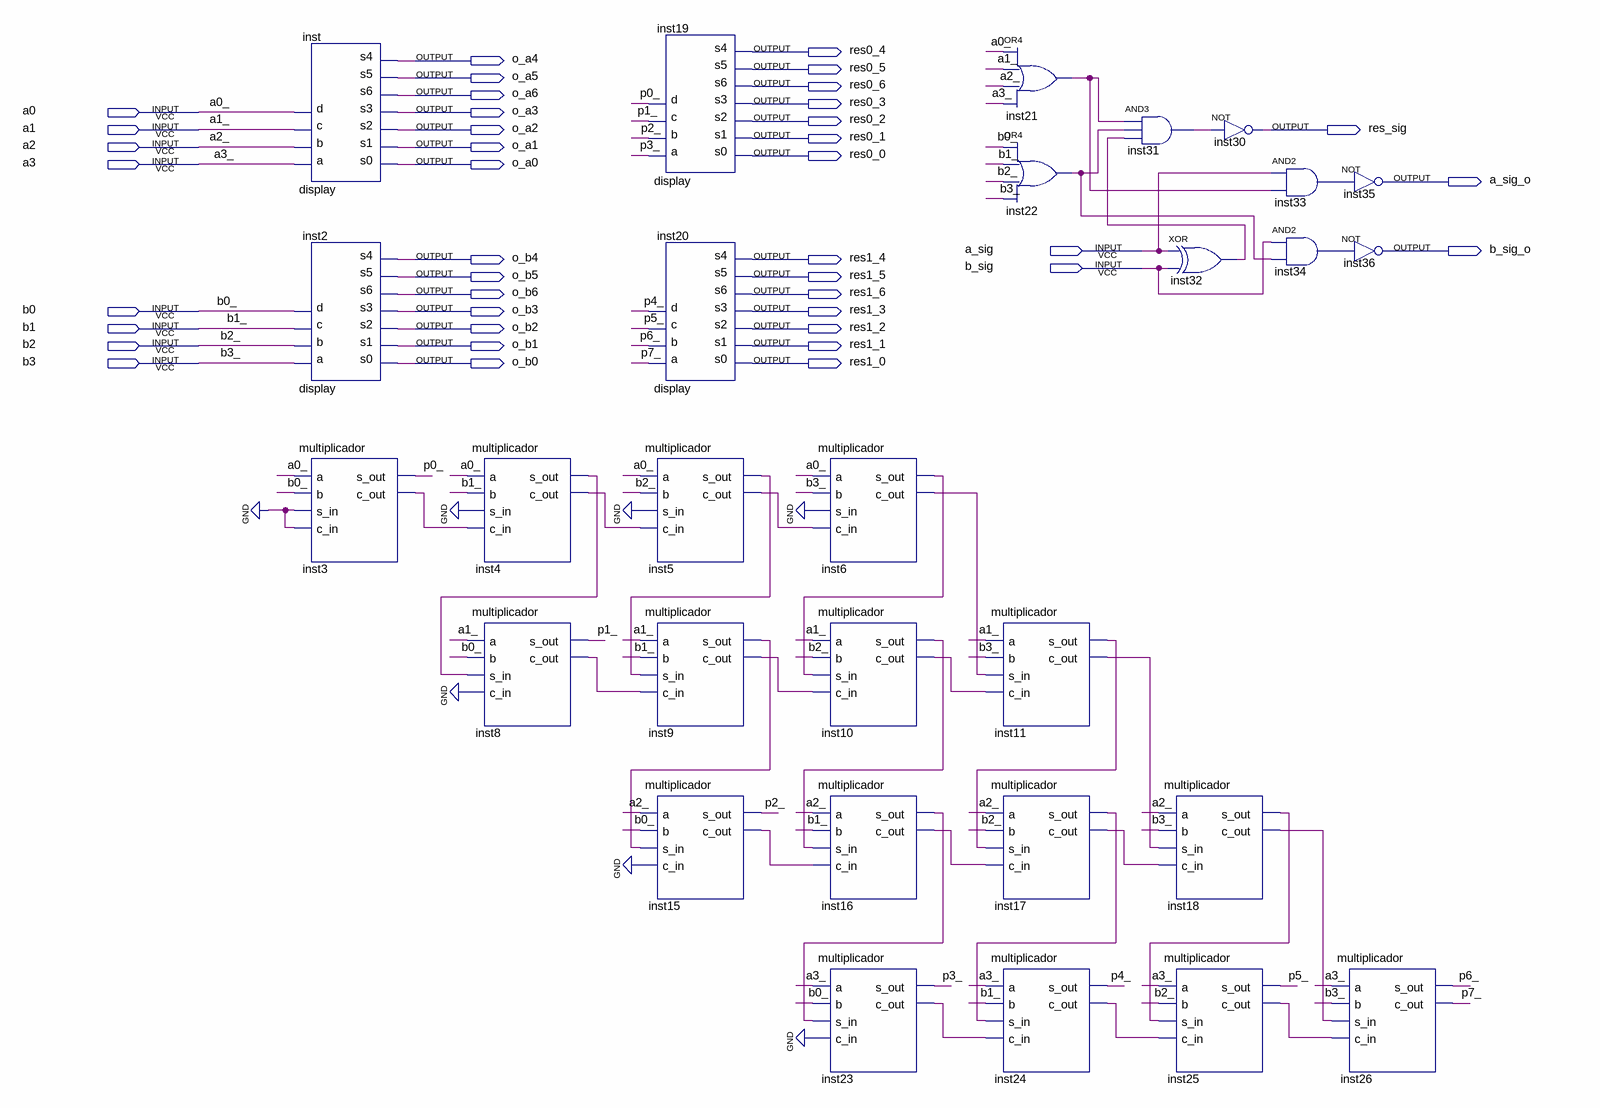
[diagram p0: schematic sheet]
// Quartus schematic aula10.bdf as structural Verilog: 29 symbols, 41 pins
module aula10 (
  input  a0,
  input  a1,
  input  a2,
  input  a3,
  input  a_sig,
  input  b_sig,
  input  b0,
  input  b1,
  input  b2,
  input  b3,
  output res0_4,
  output o_a4,
  output res0_5,
  output o_a5,
  output res0_6,
  output o_a6,
  output res0_3,
  output o_a3,
  output res0_2,
  output o_a2,
  output res_sig,
  output res0_1,
  output o_a1,
  output res0_0,
  output o_a0,
  output a_sig_o,
  output b_sig_o,
  output o_b4,
  output res1_4,
  output o_b5,
  output res1_5,
  output o_b6,
  output res1_6,
  output o_b3,
  output res1_3,
  output o_b2,
  output res1_2,
  output o_b1,
  output res1_1,
  output o_b0,
  output res1_0
);

  wire inst3_c_out, inst4_c_out, inst4_s_out, inst5_c_out, inst5_s_out, inst6_c_out, inst6_s_out,
       inst8_c_out, inst9_c_out, inst9_s_out, inst10_c_out, inst10_s_out, inst11_c_out, inst11_s_out,
       inst15_c_out, inst16_c_out, inst16_s_out, inst17_c_out, inst17_s_out, inst18_c_out, inst18_s_out,
       inst21_out, inst22_out, inst23_c_out, inst24_c_out, inst25_c_out, inst31_out, inst32_out, inst33_out,
       inst34_out, p0_, p1_, p2_, p3_, p4_, p5_, p6_, p7_;

  display inst (
    .a(a3), .b(a2), .c(a1), .d(a0), .s0(o_a0), .s1(o_a1), .s2(o_a2), .s3(o_a3), .s6(o_a6), .s5(o_a5),
    .s4(o_a4));
  display inst2 (
    .a(b3), .b(b2), .c(b1), .d(b0), .s0(o_b0), .s1(o_b1), .s2(o_b2), .s3(o_b3), .s6(o_b6), .s5(o_b5),
    .s4(o_b4));
  multiplicador inst3 (.a(a0), .b(b0), .s_in(1'b0), .c_in(1'b0), .s_out(p0_), .c_out(inst3_c_out));
  multiplicador inst4 (.a(a0), .b(b1), .s_in(1'b0), .c_in(inst3_c_out), .s_out(inst4_s_out), .c_out(inst4_c_out));
  multiplicador inst8 (.a(a1), .b(b0), .s_in(inst4_s_out), .c_in(1'b0), .s_out(p1_), .c_out(inst8_c_out));
  display inst19 (
    .a(p3_), .b(p2_), .c(p1_), .d(p0_), .s0(res0_0), .s1(res0_1), .s2(res0_2), .s3(res0_3), .s6(res0_6),
    .s5(res0_5), .s4(res0_4));
  display inst20 (
    .a(p7_), .b(p6_), .c(p5_), .d(p4_), .s0(res1_0), .s1(res1_1), .s2(res1_2), .s3(res1_3), .s6(res1_6),
    .s5(res1_5), .s4(res1_4));
  multiplicador inst5 (.a(a0), .b(b2), .s_in(1'b0), .c_in(inst4_c_out), .s_out(inst5_s_out), .c_out(inst5_c_out));
  multiplicador inst9 (
    .a(a1), .b(b1), .s_in(inst5_s_out), .c_in(inst8_c_out), .s_out(inst9_s_out), .c_out(inst9_c_out));
  multiplicador inst15 (.a(a2), .b(b0), .s_in(inst9_s_out), .c_in(1'b0), .s_out(p2_), .c_out(inst15_c_out));
  multiplicador inst6 (.a(a0), .b(b3), .s_in(1'b0), .c_in(inst5_c_out), .s_out(inst6_s_out), .c_out(inst6_c_out));
  multiplicador inst10 (
    .a(a1), .b(b2), .s_in(inst6_s_out), .c_in(inst9_c_out), .s_out(inst10_s_out), .c_out(inst10_c_out));
  multiplicador inst16 (
    .a(a2), .b(b1), .s_in(inst10_s_out), .c_in(inst15_c_out), .s_out(inst16_s_out), .c_out(inst16_c_out));
  multiplicador inst23 (.a(a3), .b(b0), .s_in(inst16_s_out), .c_in(1'b0), .s_out(p3_), .c_out(inst23_c_out));
  or inst21 (inst21_out, a0, a1, a2, a3);
  or inst22 (inst22_out, b0, b1, b2, b3);
  multiplicador inst11 (
    .a(a1), .b(b3), .s_in(inst6_c_out), .c_in(inst10_c_out), .s_out(inst11_s_out), .c_out(inst11_c_out));
  multiplicador inst17 (
    .a(a2), .b(b2), .s_in(inst11_s_out), .c_in(inst16_c_out), .s_out(inst17_s_out), .c_out(inst17_c_out));
  multiplicador inst24 (.a(a3), .b(b1), .s_in(inst17_s_out), .c_in(inst23_c_out), .s_out(p4_), .c_out(inst24_c_out));
  and inst31 (inst31_out, inst21_out, inst22_out, inst32_out);
  not inst30 (res_sig, inst31_out);
  xor inst32 (inst32_out, a_sig, b_sig);
  multiplicador inst18 (
    .a(a2), .b(b3), .s_in(inst11_c_out), .c_in(inst17_c_out), .s_out(inst18_s_out), .c_out(inst18_c_out));
  multiplicador inst25 (.a(a3), .b(b2), .s_in(inst18_s_out), .c_in(inst24_c_out), .s_out(p5_), .c_out(inst25_c_out));
  and inst33 (inst33_out, a_sig, inst21_out);
  and inst34 (inst34_out, b_sig, inst22_out);
  not inst35 (a_sig_o, inst33_out);
  not inst36 (b_sig_o, inst34_out);
  multiplicador inst26 (.a(a3), .b(b3), .s_in(inst18_c_out), .c_in(inst25_c_out), .s_out(p6_), .c_out(p7_));

  // Other names for the same wires on the sheet: a0_ = a0; a1_ = a1; a2_ = a2; a3_ = a3; b0_ = b0; b1_ = b1; b2_ = b2;
  //   b3_ = b3
endmodule
